# EAGLE design MiddleConnector (EAGLE 9.6.2)
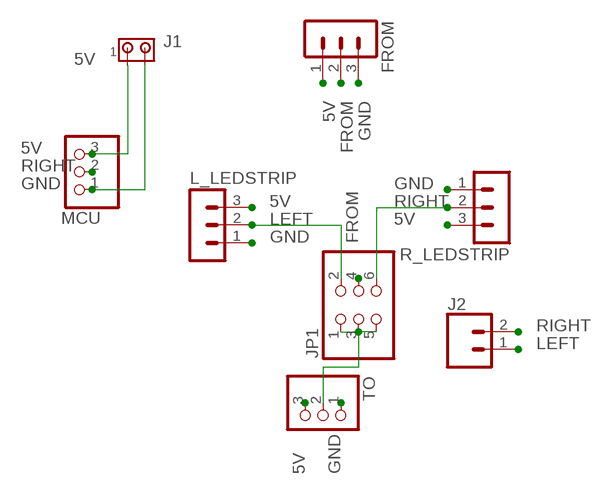
[diagram p0: schematic, sheet 1]

## Parts
FROM  MA03-1  [MA03-1]
J1  MTA02-156  [1X2MTA]
J2  CONN_02  [1X02]
JP1  PINHD-2X3  [2X03]
L_LEDSTRIP  MA03-1  [MA03-1]
MCU  PINHD-1X3/90  [1X03/90]
R_LEDSTRIP  MA03-1  [MA03-1]
TO  PINHD-1X3/90  [1X03/90]

## Nets
5V: FROM.1 J1.1 L_LEDSTRIP.3 MCU.3 R_LEDSTRIP.3 TO.3
FROM: FROM.2 JP1.4
GND: FROM.3 J1.2 L_LEDSTRIP.1 MCU.1 R_LEDSTRIP.1 TO.1
LEFT: J2.1 JP1.2 L_LEDSTRIP.2
N$2: JP1.1 JP1.3 JP1.5 TO.2
RIGHT: J2.2 JP1.6 MCU.2 R_LEDSTRIP.2

## Library data of the parts
FROM L_LEDSTRIP R_LEDSTRIP = con-lstb:MA03-1: PIN HEADER; OC_FARNELL: unknown; OC_NEWARK: unknown
J1 = con-amp:MTA02-156: AMP connector
J2 = SparkFun-Connectors:CONN_02: Multi connection point. Often used as Generic Header-pin footprint for 0.1 inch spaced/style header connections On any of the 0.1 inch spaced packages, you can populate with these: Break Away Headers - Straight <https://www.sparkfun.com/products/116> (PRT-00116) Break Away Male Headers - Right Angle <https://www.sparkfun.com/products/553> (PRT-00553) Female Headers <https://www.sparkfun.com/products/115> (PRT-00115) Break Away Headers - Machine Pin <https://www.sparkfun.com/products/117> (PRT-00117) Break Away Female Headers - Swiss Machine Pin <https://www.sparkfun.com/products/743> (PRT-00743) For SCREWTERMINALS and SPRING TERMINALS visit here: Screw Terimnals on SparkFun.com <https://www.sparkfun.com/search/results?term=Screw+Terminals> (5mm/3.5mm/2.54mm spacing) This device is also useful as a general connection point to wire up your design to another part of your project. Our various solder wires solder well into these plated through hole pads. Hook-Up Wire - Assortment (Stranded, 22 AWG) <https://www.sparkfun.com/products/11375> (PRT-11375) Hook-Up Wire - Assortment (Solid Core, 22 AWG) <https://www.sparkfun.com/products/11367> (PRT-11367) View the entire wire category on our website here <https://www.sparkfun.com/categories/141> Special notes: Molex polarized connector foot print use with: PRT-08233 with associated crimp pins and housings. 2.54_SCREWTERM for use with PRT-10571. 3.5mm Screw Terminal footprints for PRT-08084 5mm Screw Terminal footprints for use with PRT-08432
JP1 = pinhead:PINHD-2X3: PIN HEADER
MCU TO = pinhead:PINHD-1X3: PIN HEADER

## Board
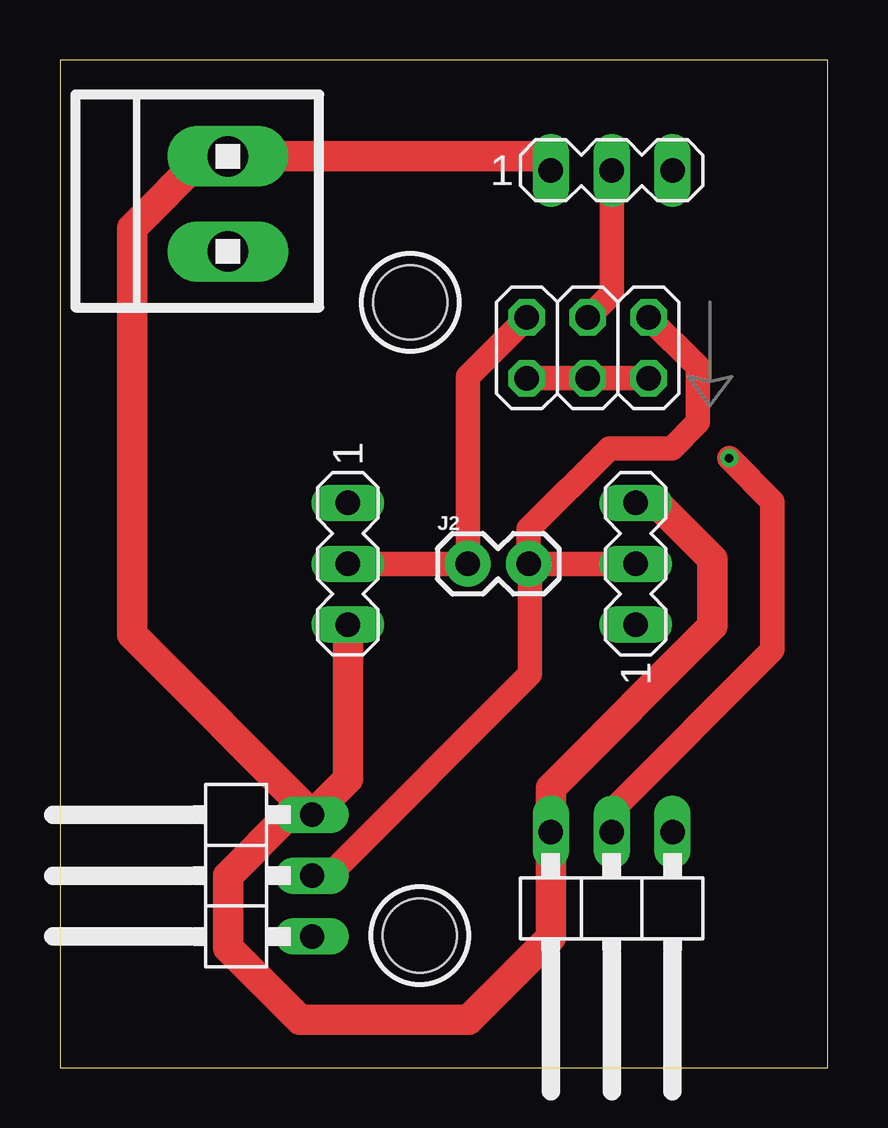
[diagram p1: board, top side]
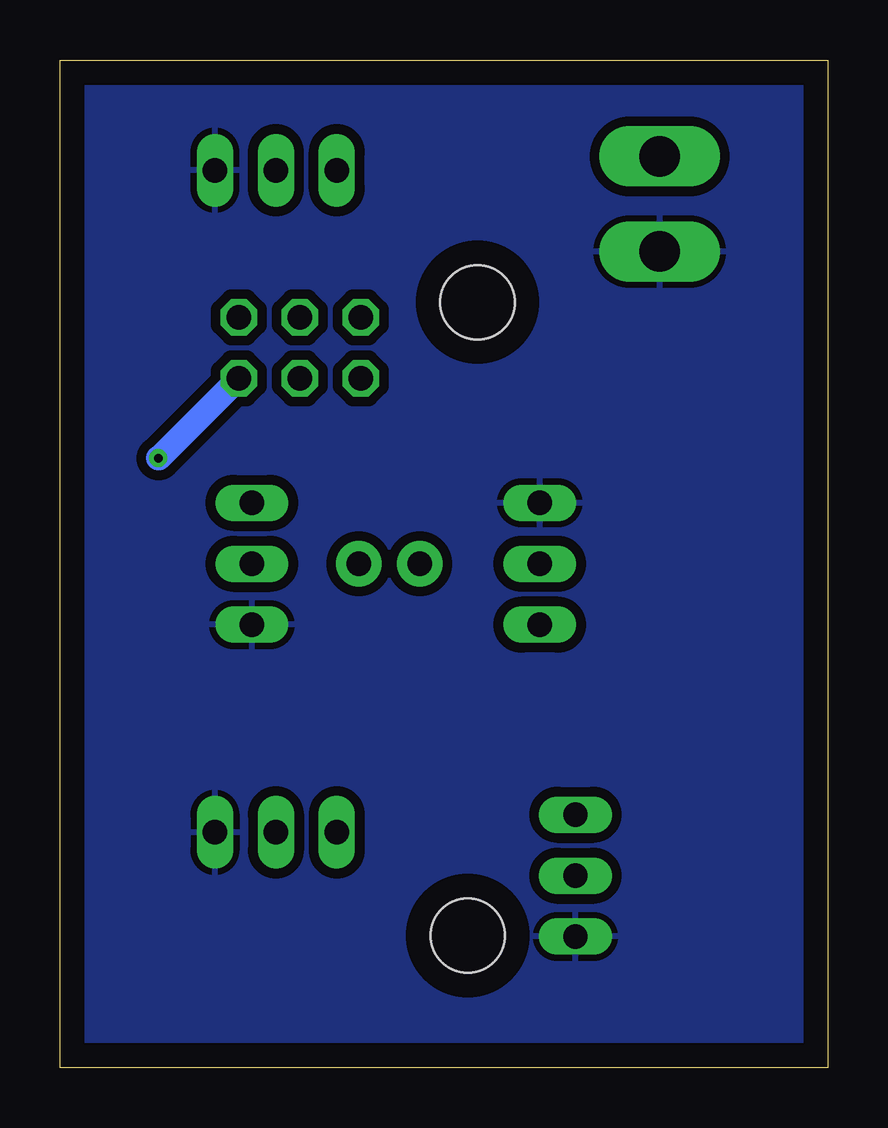
[diagram p2: board, bottom side, seen from below]

Size 32 x 42 mm. Coordinates in mm from the lower left corner, seen from the top.
Outline: 0,0 32,0 32,42 0,42 0,0
Copper layers (1*16): Top 0.035mm / dielectric 1.5mm / Bottom 0.035mm
Design rules "ACES_THT": minimum track width 18mil, minimum drill 0.35mm, track to track 10mil, track to pad 10mil, pad to pad 10mil, via to via 10mil, smd to smd 6mil, copper to edge 40mil, drill to drill 6mil, minimum pad ring 10mil, minimum via ring 8mil, stop-mask expansion 4mil, vias tented up to drill 0mil, thermal gap 10mil

### Footprints (pad centres in the part's own frame; a part is rotated, then mirrored left to right if it is on the bottom)
MA03-1 = drill 1.016 long: 1 -2.54,0; 2 0,0; 3 2.54,0
1X2MTA = drill 1.676 long: 1 1.981,0; 2 -1.981,0
1X02 = drill 1.016 pad 1.88: 1 0,0; 2 2.54,0
2X03 = drill 1.016 octagon: 1 -2.54,-1.27; 2 -2.54,1.27; 3 0,-1.27; 4 0,1.27; 5 2.54,-1.27; 6 2.54,1.27
1X03/90 = drill 1.016 long: 1 -2.54,-3.81; 2 0,-3.81; 3 2.54,-3.81
MOUNTINGHOLE_3.2MM_PLATEDTHIN = hole 3.1: 0,0

### Placement (x,y rotation side)
FROM  23,37.4 0 top
J1  7,36 90 top
J2  17,21 0 top
JP1  22,30 0 top
L_LEDSTRIP  12,21 270 top
MCU  6.7,8 90 top
R_LEDSTRIP  24,21 90 top
TO  23,6 180 top
U$1  [MOUNTINGHOLE_3.2MM_PLATEDTHIN]  14.6,31.9 0 top
U$2  [MOUNTINGHOLE_3.2MM_PLATEDTHIN]  15,5.5 0 top

### Tracks (layer width: path | path; a pad name or v marks a point on that pad's centre or on a via)
5V
  Top 1.016: FROM.1 19.88,37.98
  Top 1.27: MCU.3 3,18.05 3,35 5.98,37.98 J1.1 19.88,37.98 | MCU.3 9.54,10.54 7,8 7,5 10,2 17.03,2 20.46,5.43 TO.3 20.46,11.66 27.2,18.4 27.2,21.2 24.86,23.54 R_LEDSTRIP.3 | MCU.3 12,12.03 L_LEDSTRIP.3
FROM
  Top 1.016: FROM.2 23,32.27 JP1.4
GND
  pour Bottom (isolate 0.406): 0,42 32,42 32,0 0,0
LEFT
  Top 1.016: L_LEDSTRIP.2 J2.1 17,28.81 JP1.2
N$2  (via drill 0.35)
  Top 1.016: JP1.1 JP1.3 JP1.5 | v27.9,25.4 29.7,23.6 29.7,17.4 23,10.7 TO.2
  Bottom 1.016: JP1.5 27.87,25.4 v27.9,25.4
RIGHT
  Top 1.016: R_LEDSTRIP.2 J2.2 19.54,22.44 22.9,25.8 25.5,25.8 26.6,26.9 26.6,29.21 JP1.6 | 11.2,8 19.6,16.4 19.6,20.94
  Top 1.27: MCU.2 11.2,8 | 19.6,20.94 J2.2

### Text on the board
tDocu: 5V | GND | L | R | Middle / Connector | - | + | L | R | + | - | MCU | 5V | Data | GND
bDocu: Ping pong LED matrix v1.0 / Xander Chin